# Altium project PCB_Project1.PrjPCB
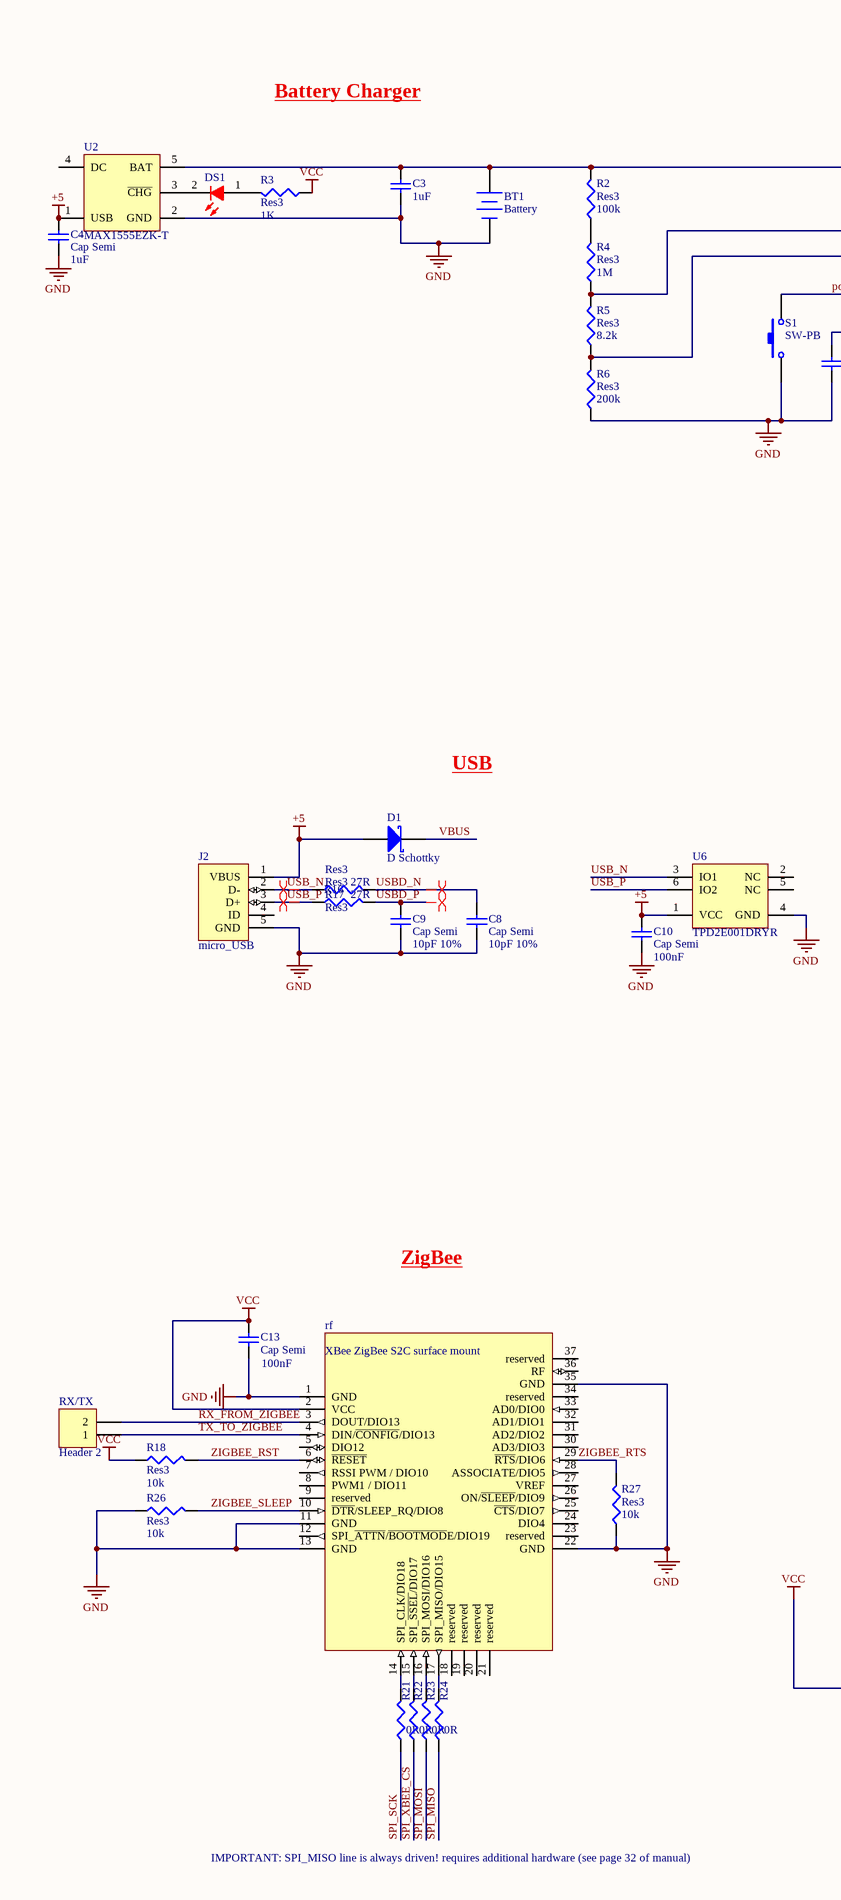
[diagram p0: mainboard.SchDoc, left]
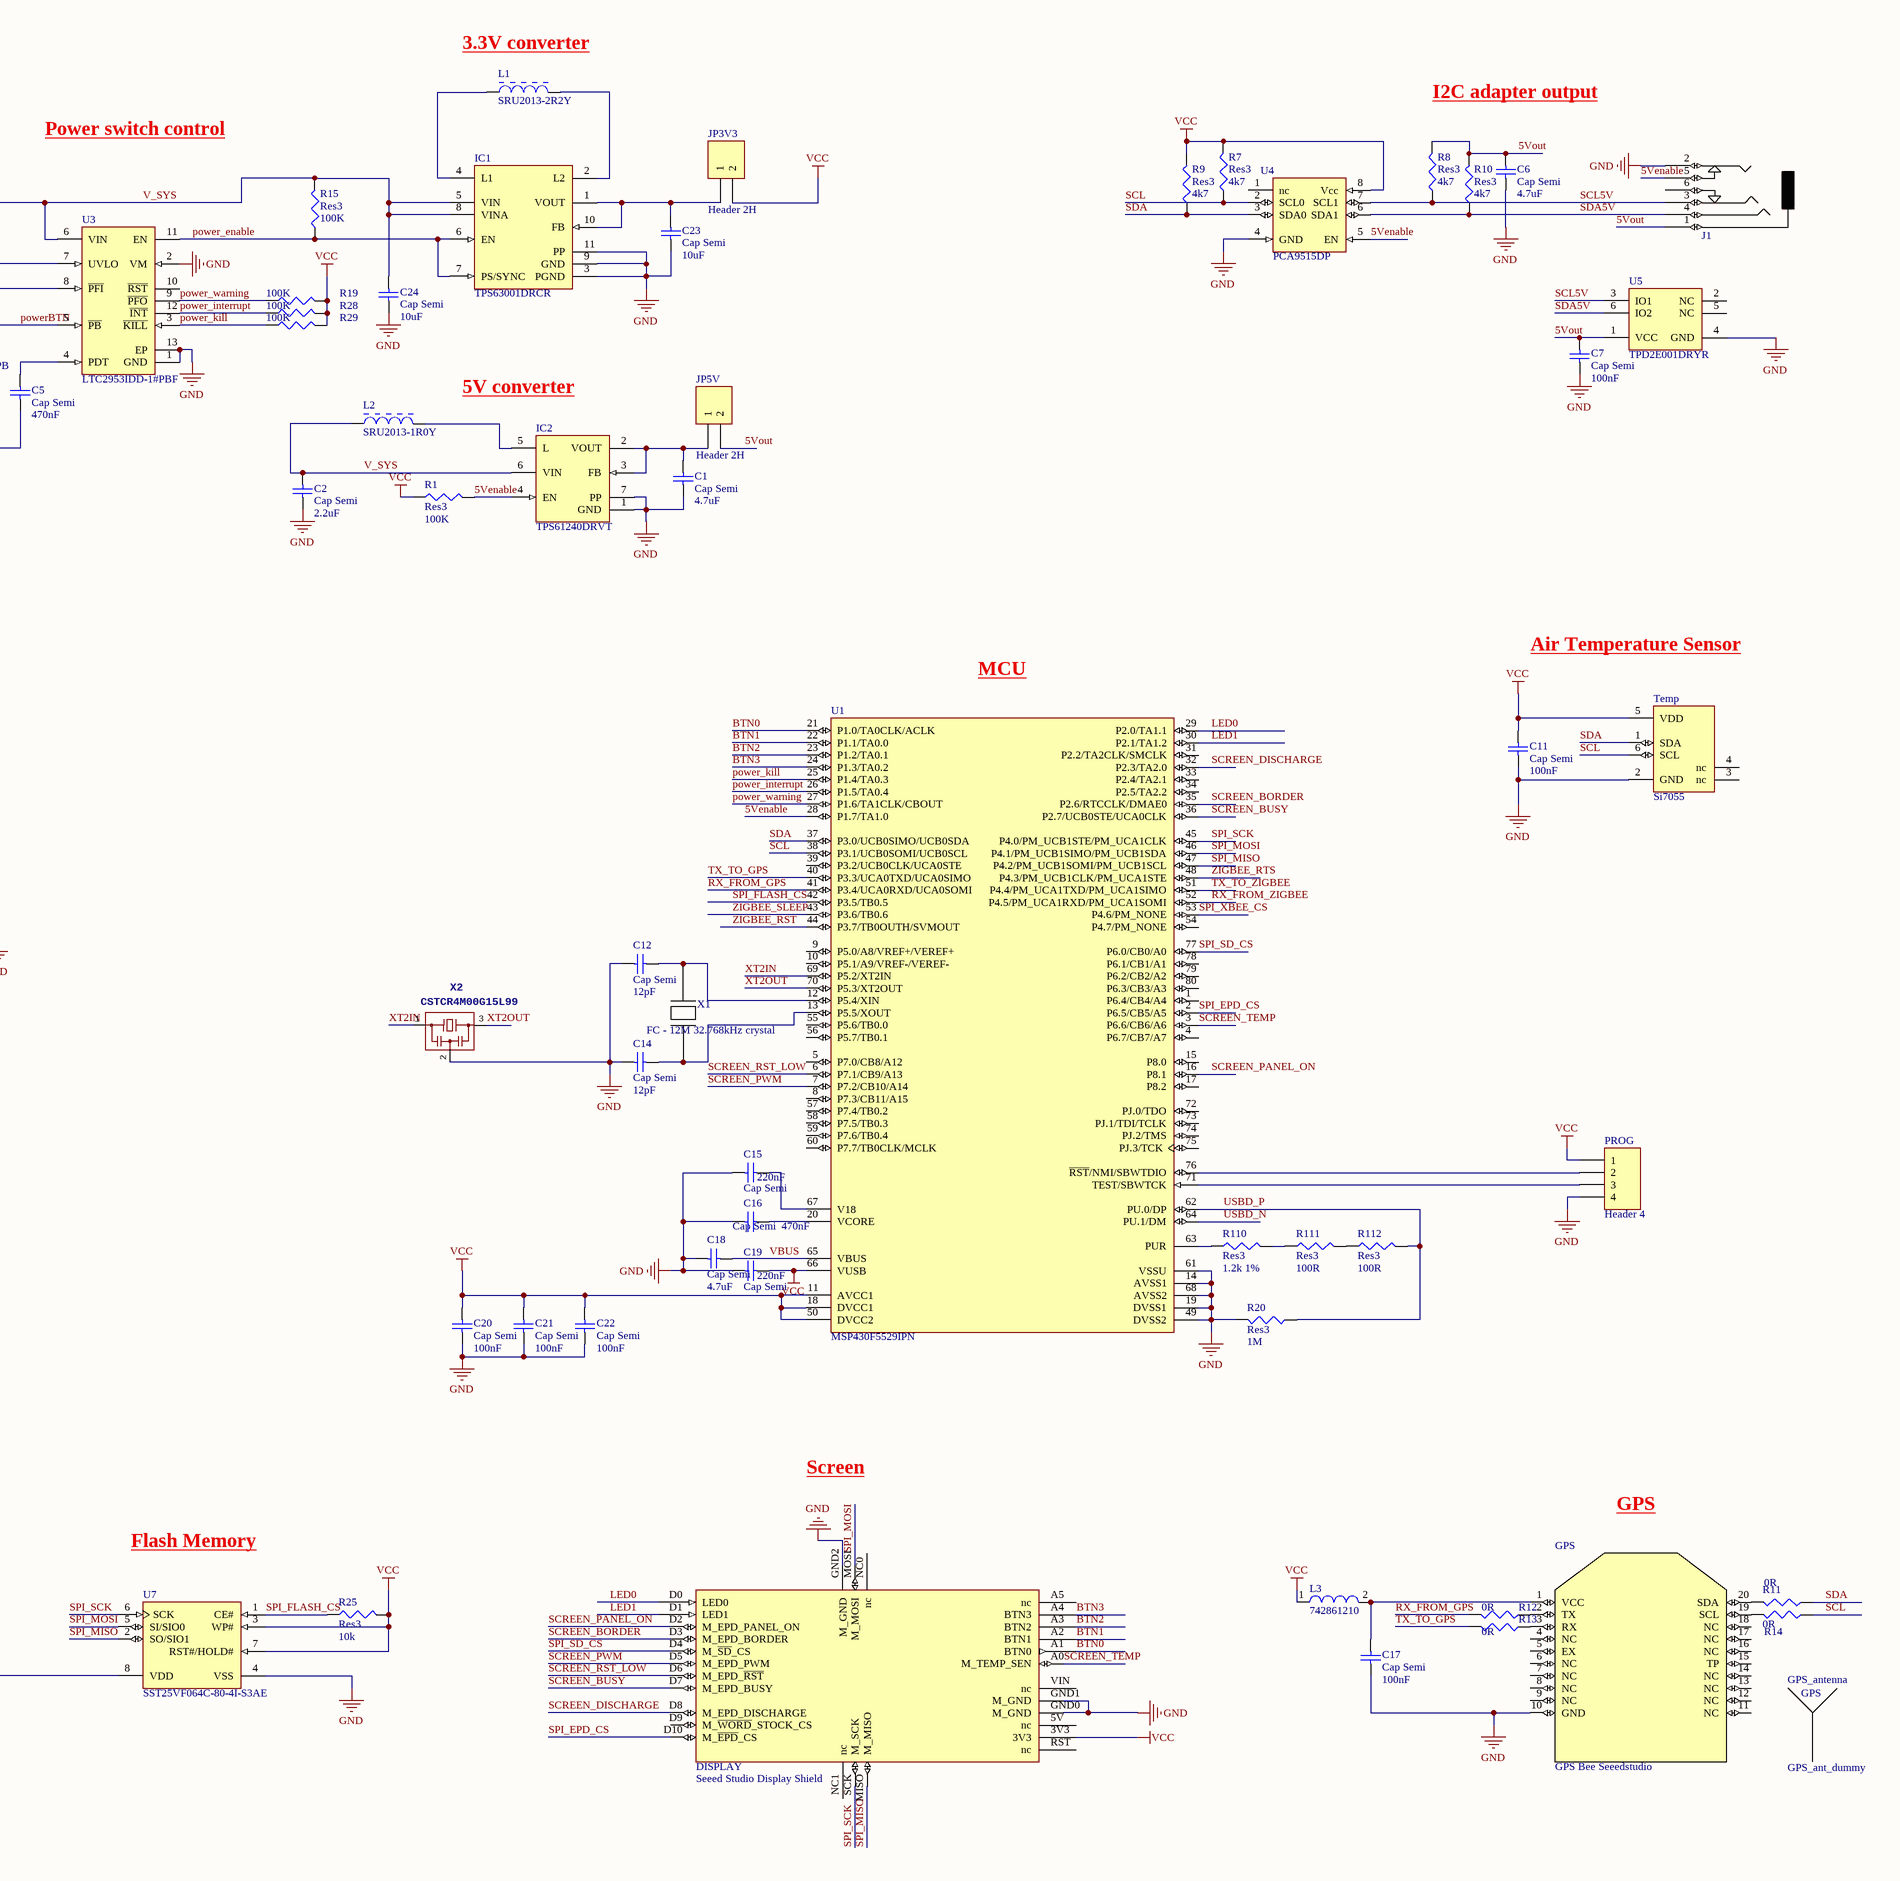
[diagram p1: mainboard.SchDoc, right]
1 sheet, 85 parts. Net scope: global (net labels, ports and power ports of the same name join across sheets).
Board file: mainboardDory.PcbDoc

## Sheet mainboard.SchDoc: dOry mainboard
size A2; Author: Raffael Tschui; DrawnBy: Raffael Tschui; Organization: OWNERPARTID=-1; DocumentNumber: 1; Revision: A; SheetNumber: 1; SheetTotal: 1; PageSetup: Record=PageOptions|CenterHorizontal=True|CenterVertical=True|PrintScale=0.50|XCorrection=1.00|YCorrection=1.00|PrintKind=1|BorderSize=5000000|LeftOffset=0|BottomOffset=0|Orientation=2|PaperLength=1000|PaperWidth=1000|Scale=100|PaperSource=7|PrintQuality=-3|MediaType=1|DitherType=10|PrintScaleMode=1|PaperKind=A4|PaperIndex=9; ProjectName: OWNERPARTID=-1

### Parts
BT1  Battery  [BAT-2]
C1  Cap Semi  value 4.7uF  [1608[0603]]
C2  Cap Semi  value 2.2uF  [1608[0603]]
C3  value 1uF  [1608[0603]]  (hidden comment: Cap Semi)
C4  Cap Semi  value 1uF  [1608[0603]]
C5  Cap Semi  value 470nF  [1608[0603]]
C6  Cap Semi  value 4.7uF  [1608[0603]]
C7  Cap Semi  value 100nF  [1608[0603]]
C8  Cap Semi  value 10pF 10%  [1608[0603]]
C9  Cap Semi  value 10pF 10%  [1608[0603]]
C10  Cap Semi  value 100nF  [1608[0603]]
C11  Cap Semi  value 100nF  [1608[0603]]
C12  Cap Semi  value 12pF  [1608[0603]]
C13  Cap Semi  value 100nF  [1608[0603]]
C14  Cap Semi  value 12pF  [1608[0603]]
C15  Cap Semi  value 220nF  [1608[0603]]
C16  Cap Semi  value 470nF  [1608[0603]]
C17  Cap Semi  value 100nF  [1608[0603]]
C18  Cap Semi  value 4.7uF  [1608[0603]]
C19  Cap Semi  value 220nF  [1608[0603]]
C20  Cap Semi  value 100nF  [1608[0603]]
C21  Cap Semi  value 100nF  [1608[0603]]
C22  Cap Semi  value 100nF  [1608[0603]]
C23  Cap Semi  value 10uF  [C1206]
C24  Cap Semi  value 10uF  [C1206]
D1  D Schottky  [SMB]
DISPLAY  Seeed Studio Display Shield  [Display shield]
DS1  TLSU1008A(T04)  [TOSH-0603LED_RED_V]  (value not drawn)
GPS  GPS Bee Seeedstudio  [GPS bee]
GPS_antenna  GPS_ant_dummy  [GPS_ant_dummy]
IC1  TPS63001DRCR  [DRC10-2400X1650TP]
IC2  TPS61240DRVT  [DRV6-1600X1000TP]
J1  Jack_6  [Jack_6_socket]  (value not drawn)
J2  micro_USB  [DX4RNW5HJ3]
JP3V3  Header 2H  [HDR1X2H]
JP5V  Header 2H  [HDR1X2H]
L1  SRU2013-2R2Y  [BOUR-SRU2013-2R2Y-2_V]
L2  SRU2013-1R0Y  [BOUR-SRU2013-2R2Y-2_V]
L3  742861210  [SMD-0603]
PROG  Header 4  [HDR1X4]
R1  Res3  value 100K  [J1-0603]
R2  Res3  value 100k  [J1-0603]
R3  Res3  value 1K  [J1-0603]
R4  Res3  value 1M  [J1-0603]
R5  Res3  value 8.2k  [J1-0603]
R6  Res3  value 200k  [J1-0603]
R7  Res3  value 4k7  [J1-0603]
R8  Res3  value 4k7  [J1-0603]
R9  Res3  value 4k7  [J1-0603]
R10  Res3  value 4k7  [J1-0603]
R11  value 0R  [J1-0603]  (hidden comment: Res3)
R12  value 0R  [J1-0603]  (hidden comment: Res3)
R13  value 0R  [J1-0603]  (hidden comment: Res3)
R14  value 0R  [J1-0603]  (hidden comment: Res3)
R15  Res3  value 100K  [J1-0603]
R16  Res3  value 27R  [J1-0603]
R17  Res3  value 27R  [J1-0603]
R18  Res3  value 10k  [J1-0603]
R19  value 100K  [J1-0603]  (hidden comment: Res3)
R20  Res3  value 1M  [J1-0603]
R21  value 0R  [J1-0603]  (hidden comment: Res3)
R22  value 0R  [J1-0603]  (hidden comment: Res3)
R23  value 0R  [J1-0603]  (hidden comment: Res3)
R24  value 0R  [J1-0603]  (hidden comment: Res3)
R25  Res3  value 10k  [J1-0603]
R26  Res3  value 10k  [J1-0603]
R27  Res3  value 10k  [J1-0603]
R28  value 100K  [J1-0603]  (hidden comment: Res3)
R29  value 100K  [J1-0603]  (hidden comment: Res3)
R110  Res3  value 1.2k 1%  [J1-0603]
R111  Res3  value 100R  [J1-0603]
R112  Res3  value 100R  [J1-0603]
rf  XBee ZigBee S2C surface mount  [S2C XBEE]
RX/TX  Header 2  [HDR1X2]
S1  SW-PB  [SPST-2]
Temp  Si7055  [Si7050/3/4/5]
U1  MSP430F5529IPN  [TI-PN80_N]
U2  MAX1555EZK-T  [MAXM-Z5-1_N]
U3  LTC2953IDD-1#PBF  [LT-DD-12_V]
U4  PCA9515DP  [TSOP65P490X110-8N]
U5  TPD2E001DRYR  [DRY6]
U6  TPD2E001DRYR  [DRY6]
U7  SST25VF064C-80-4I-S3AE  [MCHP-SOIC-S3A8_M]
X1  FC - 12M 32.768kHz crystal  [FC-12M]
X2  CSTCR4M00G15L99  [CSTCR_G15L]

### Nets
+5: C4.2 C10.2 D1.1(A) J2.1(VBUS) U2.1(USB) U6.1(VCC)
GND: BT1.2(-) C1.1 C2.1 C3.1 C4.1 C5.1 C6.1 C7.1 C8.1 C9.1 C10.1 C11.1 C12.1 C13.1 C14.1 C15.2 C16.2 C17.1 C18.1 C19.2 C20.1 C21.1 C22.1 C23.1 C24.2 DISPLAY.GND0(M_GND) DISPLAY.GND1(M_GND) DISPLAY.GND2(M_GND) GPS.10(GND) IC1.3(PGND) IC1.9(GND) IC1.11(PP) IC2.1(GND) IC2.7(PP) J1.2(tip) J2.5(GND) PROG.4 R6.1 R20.2 R26.1 R27.1 rf.1(GND) rf.11(GND) rf.13(GND) rf.22(GND) rf.35(GND) S1.1 Temp.2(GND) U1.14(AVSS1) U1.19(DVSS1) U1.49(DVSS2) U1.61(VSSU) U1.68(AVSS2) U2.2(GND) U3.1(GND) U3.2(VM) U3.13(EP) U4.4(GND) U5.4(GND) U6.4(GND) U7.4(VSS) X2.2
VCC: C11.2 C13.2 C19.1 C20.2 C21.2 C22.2 DISPLAY.3V3 JP3V3.2 L3.1 PROG.1 R1.1 R3.1 R7.2 R9.2 R18.1 R19.2 R25.2 R28.2 R29.2 rf.2(VCC) Temp.5(VDD) U1.11(AVCC1) U1.18(DVCC1) U1.50(DVCC2) U1.66(VUSB) U4.8(Vcc) U7.3(WP#) U7.7(RST#/HOLD#) U7.8(VDD)
5Venable: IC2.4(EN) J1.5(tip_switch) R1.2 U1.28(P1.7/TA1.0) U4.5(EN)
5Vout: C6.2 C7.2 J1.1(sleeve) JP5V.2 R8.2 R10.2 U5.1(VCC)
BTN0: DISPLAY.A1(BTN0) U1.21(P1.0/TA0CLK/ACLK)
BTN1: DISPLAY.A2(BTN1) U1.22(P1.1/TA0.0)
BTN2: DISPLAY.A3(BTN2) U1.23(P1.2/TA0.1)
BTN3: DISPLAY.A4(BTN3) U1.24(P1.3/TA0.2)
LED0: DISPLAY.D0(LED0) U1.29(P2.0/TA1.1)
LED1: DISPLAY.D1(LED1) U1.30(P2.1/TA1.2)
power_enable: IC1.6(EN) IC1.7(PS/SYNC) R15.1 U3.11(EN)
power_interrupt: R28.1 U1.26(P1.5/TA0.4) U3.12(~{INT})
power_kill: R29.1 U1.25(P1.4/TA0.3) U3.3(~{KILL})
power_warning: R19.1 U1.27(P1.6/TA1CLK/CBOUT) U3.9(~{PFO})
powerBTN: S1.2 U3.5(~{PB})
RX_FROM_GPS: R12.2 U1.41(P3.4/UCA0RXD/UCA0SOMI)
RX_FROM_ZIGBEE: rf.3(DOUT/DIO13) RX/TX.2 U1.52(P4.5/PM_UCA1RXD/PM_UCA1SOMI)
SCL: R7.1 R14.1 Temp.6(SCL) U1.38(P3.1/UCB0SOMI/UCB0SCL) U4.2(SCL0)
SCL5V: J1.3(ring_1) R8.1 U4.7(SCL1) U5.3(IO1)
SCREEN_BORDER: DISPLAY.D3(M_EPD_BORDER) U1.35(P2.6/RTCCLK/DMAE0)
SCREEN_BUSY: DISPLAY.D7(M_EPD_BUSY) U1.36(P2.7/UCB0STE/UCA0CLK)
SCREEN_DISCHARGE: DISPLAY.D8(M_EPD_DISCHARGE) U1.32(P2.3/TA2.0)
SCREEN_PANEL_ON: DISPLAY.D2(M_EPD_PANEL_ON) U1.16(P8.1)
SCREEN_PWM: DISPLAY.D5(M_EPD_PWM) U1.7(P7.2/CB10/A14)
SCREEN_RST_LOW: DISPLAY.D6(M_EPD_~{RST}) U1.6(P7.1/CB9/A13)
SCREEN_TEMP: DISPLAY.A0(M_TEMP_SEN) U1.3(P6.6/CB6/A6)
SDA: R9.1 R11.1 Temp.1(SDA) U1.37(P3.0/UCB0SIMO/UCB0SDA) U4.3(SDA0)
SDA5V: J1.4(ring_2) R10.1 U4.6(SDA1) U5.6(IO2)
SPI_EPD_CS: DISPLAY.D10(M_~{EPD}_CS) U1.2(P6.5/CB5/A5)
SPI_FLASH_CS: R25.1 U1.42(P3.5/TB0.5) U7.1(CE#)
SPI_MISO: DISPLAY.MISO(M_MISO) R24.1 U1.47(P4.2/PM_UCB1SOMI/PM_UCB1SCL) U7.2(SO/SIO1)
SPI_MOSI: DISPLAY.MOSI(M_MOSI) R23.1 U1.46(P4.1/PM_UCB1SIMO/PM_UCB1SDA) U7.5(SI/SIO0)
SPI_SCK: DISPLAY.SCK(M_SCK) R21.1 U1.45(P4.0/PM_UCB1STE/PM_UCA1CLK) U7.6(SCK)
SPI_SD_CS: DISPLAY.D4(M_~{SD}_CS) U1.77(P6.0/CB0/A0)
SPI_XBEE_CS: R22.1 U1.53(P4.6/PM_NONE)
TX_TO_GPS: R13.2 U1.40(P3.3/UCA0TXD/UCA0SIMO)
TX_TO_ZIGBEE: rf.4(DIN/~{CONFIG}/DIO13) RX/TX.1 U1.51(P4.4/PM_UCA1TXD/PM_UCA1SIMO)
USB_N: J2.2(D-) R17.1 U6.3(IO1)
USB_P: J2.3(D+) R16.1 U6.6(IO2)
USBD_N: C8.2 R17.2 U1.64(PU.1/DM)
USBD_P: C9.2 R16.2 R20.1 R112.2 U1.62(PU.0/DP)
V_SYS: BT1.1(+) C2.2 C3.2 C24.1 IC1.5(VIN) IC1.8(VINA) IC2.6(VIN) L2.1 R2.2 R15.2 U2.5(BAT) U3.6(VIN)
VBUS: C18.2 D1.2(K) U1.65(VBUS)
XT2IN: U1.69(P5.2/XT2IN) X2.1
XT2OUT: U1.70(P5.3/XT2OUT) X2.3
ZIGBEE_RST: R18.2 rf.6(~{RESET}) U1.44(P3.7/TB0OUTH/SVMOUT)
ZIGBEE_RTS: R27.2 rf.29(~{RTS}/DIO6) U1.48(P4.3/PM_UCB1CLK/PM_UCA1STE)
ZIGBEE_SLEEP: R26.2 rf.10(~{DTR}/SLEEP_RQ/DIO8) U1.43(P3.6/TB0.6)
NetC1_2: C1.2 IC2.2(VOUT) IC2.3(FB) JP5V.1
NetC5_2: C5.2 U3.4(PDT)
NetC12_2: C12.2 U1.12(P5.4/XIN) X1.2
NetC14_2: C14.2 U1.13(P5.5/XOUT) X1.1
NetC15_1: C15.1 U1.67(V18)
NetC16_1: C16.1 U1.20(VCORE)
NetC17_2: C17.2 GPS.1(VCC) L3.2
NetC23_2: C23.2 IC1.1(VOUT) IC1.10(FB) JP3V3.1
NetDS1_1: DS1.1(A) R3.2
NetDS1_2: DS1.2(K) U2.3(~{CHG})
NetGPS_2: GPS.2(TX) R12.1
NetGPS_3: GPS.3(RX) R13.1
NetGPS_19: GPS.19(SCL) R14.2
NetGPS_20: GPS.20(SDA) R11.2
NetIC1_2: IC1.2(L2) L1.2
NetIC1_4: IC1.4(L1) L1.1
NetIC2_5: IC2.5(L) L2.2
NetPROG_2: PROG.2 U1.76(~{RST}/NMI/SBWTDIO)
NetPROG_3: PROG.3 U1.71(TEST/SBWTCK)
NetR2_1: R2.1 R4.2
NetR4_1: R4.1 R5.2 U3.7(UVLO)
NetR5_1: R5.1 R6.2 U3.8(~{PFI})
NetR21_2: R21.2 rf.14(SPI_CLK/DIO18)
NetR22_2: R22.2 rf.15(SPI_~{SSEL}/DIO17)
NetR23_2: R23.2 rf.16(SPI_MOSI/DIO16)
NetR24_2: R24.2 rf.17(SPI_MISO/DIO15)
NetR110_1: R110.1 U1.63(PUR)
NetR110_2: R110.2 R111.1
NetR111_2: R111.2 R112.1

Not connected (* = marked no-connect by the designer): DISPLAY 5V(nc) A5(nc) D9(M_~{WORD}_STOCK_CS) NC0(nc) NC1(nc) RST(nc) VIN(nc); GPS 4(NC) 5(EX) 6(NC) 7(NC) 8(NC) 9(NC) 11(NC) 12(NC) 13(NC) 14(NC) 15(TP) 16(NC) 17(NC) 18(NC); J1 6(ring_1_switch); J2 4(ID); rf 5(DIO12) 7(RSSI_PWM_/_DIO10) 8(PWM1_/_DIO11) 9(reserved) 12(SPI_~{ATTN}/~{BOOTMOD}E/DIO19) 18(reserved) 19(reserved) 20(reserved) 21(reserved) 23(reserved) 24(DIO4) 25(~{CTS}/DIO7) 26(ON/~{SLEEP}/DIO9) 27(VREF) 28(ASSOCIATE/DIO5) 30(AD3/DIO3) 31(AD2/DIO2) 32(AD1/DIO1) 33(AD0/DIO0) 34(reserved) 36(RF) 37(reserved); Temp 3(nc) 4(nc); U1 1(P6.4/CB4/A4) 4(P6.7/CB7/A7) 5(P7.0/CB8/A12) 8(P7.3/CB11/A15) 9(P5.0/A8/VREF+/VEREF+) 10(P5.1/A9/VREF-/VEREF-) 15(P8.0) 17(P8.2) 31(P2.2/TA2CLK/SMCLK) 33(P2.4/TA2.1) 34(P2.5/TA2.2) 39(P3.2/UCB0CLK/UCA0STE) 54(P4.7/PM_NONE) 55(P5.6/TB0.0) 56(P5.7/TB0.1) 57(P7.4/TB0.2) 58(P7.5/TB0.3) 59(P7.6/TB0.4) 60(P7.7/TB0CLK/MCLK) 72(PJ.0/TDO) 73(PJ.1/TDI/TCLK) 74(PJ.2/TMS) 75(PJ.3/TCK) 78(P6.1/CB1/A1) 79(P6.2/CB2/A2) 80(P6.3/CB3/A3); U2 4(DC); U3 10(~{RST}); U4 1(nc); U5 2(NC) 5(NC); U6 2(NC) 5(NC)

### Layout directives
differential pair: USB_N, USB_P, USBD_N, USBD_P

### Notes on the sheet
- (near L1) 3.3V converter
- I2C adapter output
- Battery Charger
- Power switch control
- 5V converter
- Air Temperature Sensor
- MCU
- USB
- ZigBee
- Screen
- GPS
- Flash Memory
- IMPORTANT: SPI_MISO line is always driven! requires additional hardware (see page 32 of manual)
- Title
- Size:
- Date:
- File:
- A2
- Number:
- Time:
- Revision:
- Sheet
- of
- (in symbol GPS_ant_dummy) GPS

### Library data of the parts
BT1 = Battery: Multicell Battery; Published: 24-Mar-1999; LatestRevisionDate: 17-Jul-2002; LatestRevisionNote: Re-released for DXP Platform.; PackageReference: BAT-2; Publisher: Altium Limited; PackageDescription: Battery; 2 Leads
C1-C24 = Cap Semi: Capacitor (Semiconductor SIM Model); Published: 8-Jun-2000; LatestRevisionDate: 29-May-2009; LatestRevisionNote: IPC-7351 Footprint Added.; PackageReference: C1206; Publisher: Altium Limited; PackageDescription: Chip Capacitor
D1 = D Schottky: Schottky Diode; Published: 8-Jun-2000; LatestRevisionDate: 17-Jul-2002; LatestRevisionNote: Re-released for DXP Platform.; PackageReference: SMB; Publisher: Altium Limited; PackageDescription: DO-214-AA/SMB; 2 C-Bend Leads; Body 5.3 x 3.6 mm, inc. leads (LxW); Code_JEDEC: DO-214-AA
DS1 = CMP-0444-00001-1: LED, Red 0603 (1608) 63mCd; Manufacturer: Toshiba; Forward Current: 25 mA; Power Dissipation: 60 mW; Packing Type: Reel; Reverse Voltage: 4 V; Mounting Technology: Surface Mount; PackageDescription: 2-Pin SMT LED, 1.6 x 0.8 mm Pitch; ComponentLink1URL: http://www.toshiba-components.com/; ComponentLink1Description: Manufacturer URL; PackageReference: 0603LED_RED; PartNumber: TLSU1008A(T04); ComponentLink2URL: http://www.semicon.toshiba.co.jp/info/docget.jsp?type=datasheet&lang=en&pid=TLSU1008A(T04); ComponentLink2Description: Datasheet; DatasheetVersion: Aug-08; Storage Temperature: -40 to 100 degC
IC1 = CMP-0345-00006-1: Buck-Boost Voltage Converter with 1.8 to 5.5 V Input and 3.3 V Output, -40 to 85 degC, 10-Pin SON (DRC), Green (RoHS & no Sb/Br); Manufacturer: Texas Instruments; Regulated Outputs(#): 1; Preset Vout(V): 3.3; SubFamily: Buck-Boost Regulator; Iq(Typ)(mA): 0.03; Dynamic Voltage Scaling: TRUE; Vin(Max)(V): 5.5; Vin(Min)(V): 1.8; Switching Frequency(Max)(kHz): 1500; Iout(Max)(A): 1.2; ComponentLink1URL: http://www.ti.com/general/docs/lit/getliterature.tsp?genericPartNumber=TPS63001&fileType=pdf; PartNumber: TPS63001DRCR; PackageDescription: 10-Pin Plastic Small Outline No-Lead, 3 x 3 x 1 mm Body, 0.5 mm Pitch, Exposed Pad; Vout(Min)(V): 3.3; PackageReference: DRC10-2400X1650TP; Topology: Buck-Boost; ComponentLink2Description: Package Specification; Eco-Plan: Green (RoHS & no Sb/Br); PackageVersion: revL, Sep-2011; ComponentLink2URL: http://www.ti.com/litv/pdf/mpds117k; Mounting Technology: Surface Mount; ComponentLink1Description: Datasheet; DatasheetVersion: SLVS520B; Synchronous Rectification: TRUE; Vout(Max)(V): 3.3
IC2 = CMP-0343-00063-1: Boost Voltage Converter with 2.3 to 5.5 V Input and 5 V Output, 6-Pin SON (DRV), Green (RoHS & no Sb/Br); Manufacturer: Texas Instruments; Regulated Outputs(#): 1; Vin(Max)(V): 5.5; Vout(Min)(V): 5; SubFamily: Step-Up Regulator; Synchronous Rectification: TRUE; Switching Frequency(Max)(kHz): 4000; Vin(Min)(V): 2.3; ComponentLink1URL: http://www.ti.com/general/docs/lit/getliterature.tsp?genericPartNumber=TPS61240&fileType=pdf; PackageReference: DRV6-1600X1000TP; Topology: Boost; Mounting Technology: Surface Mount; PackageVersion: revE, Oct-2010; Eco-Plan: Green (RoHS & no Sb/Br); DatasheetVersion: SLVS806B; Vout(Max)(V): 5; PartNumber: TPS61240DRVT; PackageDescription: 6-Pin Plastic Small Outline No-Lead, 2 x 2 x 0.8 mm Body, 0.65 mm Pitch, Exposed Pad; ComponentLink1Description: Datasheet; Preset Vout(V): 5; ComponentLink2URL: http://www.ti.com/litv/pdf/mpds216d; ComponentLink2Description: Package Specification
J1 = Jack_6: 4 pin 6 contact headphone jack 3.5mm
J2 = micro_USB: waterproof USB 2.0 Standard Micro-USB Connector, Micro AB-Standard (Bottom Mount), 30 V AC, -30 to 85 degC, Right Angle, 5-Pin 7.5 x 5.6 x 2.8 mm SMD, RoHS,; PartNumber: ZX62D-AB-5P8; Manufacturer: Hirose Electric; Contact Resistance: 30 mOhm Max.; Packing: Reel; Number of Contacts: 5; Capacitance: 2 pF Max.; Voltage Rating: 30 V AC; Mounting Technology: Surface Mount; ComponentLink2Description: Datasheet; DatasheetVersion: Aug-14; RoHS: TRUE; ComponentLink2URL: http://www.hirose.co.jp/cataloge_hp/ed_ZX_20140804.pdf; Operating Temperature Range: -30 to 85 degC; PackageDescription: USB Micro-AB Connector, Right Angle, Body 7.5 x 5.6 mm, Pitch 0.65 mm, Height 2.8 mm; ComponentLink1URL: http://www.hirose.com/; ComponentLink1Description: Manufacturer URL; ComponentLink3URL: http://www.hirose.co.jp/cataloge_hp/ed_ZX_20140804.pdf; ComponentLink3Description: Package Specification
JP3V3 JP5V = Header 2H: Header, 2-Pin, Right Angle; LatestRevisionDate: 17-Jul-2002; LatestRevisionNote: Re-released for DXP Platform.; Publisher: Altium Limited
L1 = CMP-0462-00001-2: Power Inductor, 2.2 µH, 1.45 Irms Max(A), SMD; Manufacturer: Bourns; Frequency - Self Resonant: 100 MHz; Tolerance: +/-30%; Current Rating: 1.45 A; Inductance: 2.2 uH; DC Resistance (DCR): 120 mOhm Max; Current - Saturation: 950 mA; ComponentLink3URL: http://www.bourns.com/data/global/pdfs/SRU2013.pdf; DatasheetVersion: 2/13/2013; PartNumber: SRU2013-2R2Y; PackageDescription: 2-Pin Hand Drawn, Body 2.8 x 2.8 mm; ComponentLink2URL: http://www.bourns.com/data/global/pdfs/SRU2013.pdf; Mounting Technology: Surface Mount; PackageReference: SRU2013-2R2Y-2; ComponentLink3Description: Package Specification; Operating Temperature: -40 to 125 degC; ComponentLink1URL: http://www.bourns.com; ComponentLink2Description: Datasheet; ComponentLink1Description: Manufacturer URL
L2 = CMP-0462-00001-2: Power Inductor, 2.2 µH, 1.45 Irms Max(A), SMD; PartNumber: SRU2013-2R2Y; Manufacturer: Bourns; Frequency - Self Resonant: 100 MHz; Tolerance: +/-30%; Current Rating: 2 A; Inductance: 1.0 uH; DC Resistance (DCR): 120 mOhm Max; Current - Saturation: 950 mA; ComponentLink3URL: http://www.bourns.com/data/global/pdfs/SRU2013.pdf; DatasheetVersion: 2/13/2013; PackageDescription: 2-Pin Hand Drawn, Body 2.8 x 2.8 mm; ComponentLink2URL: http://www.bourns.com/data/global/pdfs/SRU2013.pdf; Mounting Technology: Surface Mount; PackageReference: SRU2013-2R2Y-2; ComponentLink3Description: Package Specification; Operating Temperature: -40 to 125 degC; ComponentLink1URL: http://www.bourns.com; ComponentLink2Description: Datasheet; ComponentLink1Description: Manufacturer URL
L3 = CMP-0220-00121-1: SMD EMI Suppression Ferrite Bead WE-CBF HF, Z = 1000 Ohm; PackageDescription: Chip Inductor, 2-Leads, Body 1.6 x 0.8 mm; PackageReference: SMD-0603; DatasheetVersion: ver 2, Aug-2009; ComponentLink2Description: Datasheet; ComponentLink1Description: Manufacturer Link; Impedance: 1000 Ohm; PackageVersion: 2009; ComponentLink2URL: http://www.we-online.de/katalog/media/pdf/742861210.pdf; ComponentLink1URL: http://www.we-online.com
PROG = Header 4: Header, 4-Pin; LatestRevisionDate: 17-Jul-2002; LatestRevisionNote: Re-released for DXP Platform.; Publisher: Altium Limited
R1-R29 R110-R112 = Res3: Resistor; Published: 8-Jun-2000; LatestRevisionDate: 29-May-2009; LatestRevisionNote: IPC-7351 Footprint Added.; PackageReference: J1-0603; Publisher: Altium Limited; PackageDescription: Chip Resistor
  R16: Comment_1: Res3
RX/TX = Header 2: Header, 2-Pin; LatestRevisionDate: 17-Jul-2002; LatestRevisionNote: Re-released for DXP Platform.; Publisher: Altium Limited
S1 = SW-PB: Switch; Published: 24-Mar-1999; LatestRevisionDate: 17-Jul-2002; LatestRevisionNote: Re-released for DXP Platform.; PackageReference: SPST-2; Publisher: Altium Limited; PackageDescription: Switch; 2 Leads
U1 = CMP-0365-00412-1: 25 MHz Mixed Signal Microcontroller with 128 KB Flash, 8192 B SRAM and 63 GPIOs, -40 to 85 degC, 80-pin QFP (PN), Green (RoHS & no Sb/Br); Manufacturer: Texas Instruments; Real-Time Clock: Yes; Multiplier: 32x32; Frequency(MHz): 25; USCI_A (UART/LIN/IrDA/SPI): 2; SubFamily: 5 Series; Timers - 16-bit: 4; ADC Channels: 16; GPIO: 63; SRAM(B): 8192; DMA: 3; ADC: 12-bit SAR; Flash(KB): 128; USB: 1; Code_JEDEC: MS-018; ComponentLink1URL: http://www.ti.com/; ComponentLink2URL: http://www.ti.com/general/docs/lit/getliterature.tsp?genericPartNumber=MSP430F5529&fileType=pdf; Brown Out Reset: Yes; SVS: Yes; ComponentLink2Description: Datasheet; Comparators: Yes; ComponentLink3Description: Package Specification; ComponentLink1Description: Manufacturer URL; PackageDescription: 80-Pin Plastic Quad Flat Pack, Body 12 x 12 mm, Pitch 0.5 mm; PartNumber: MSP430F5529IPN; USCI_B (I2C & SPI): 2; PackageReference: PN80; Watchdog: Yes; Temp Sensor: Yes; Eco-Plan: Green (RoHS & no Sb/Br); ComponentLink3URL: http://www.ti.com/lit/ml/mtqf010a/mtqf010a.pdf; Mounting Technology: Surface Mount; DatasheetVersion: SLAS590I
U2 = CMP-0246-00653-1: Dual-Input USB/AC Adapter 1-Cell Li+ Battery Charger, 4.2 V Charger Voltage, 0.28 A DC Charging Current, 5-Pin SOT23 Package, Tape and Reel; Manufacturer: Maxim; ICHG Typ: 0.28 A; Max Protected VIN (V): 7; Charger (V): 4.2; Lithium Ion Cells: 1; ComponentLink1Description: Manufacturer URL; Operating Temperature Range: -40 to 85 degC; PackageDescription: 5-Pin Thin SOT23, Body 2.9 x 1.6 mm, Pitch 0.95 mm; Mounting Technology: Surface Mount; PartNumber: MAX1555EZK-T; Package: SOT-23; Max Charging VIN (V): 7; ComponentLink2URL: http://datasheets.maximintegrated.com/en/ds/MAX1551-MAX1555.pdf; DatasheetVersion: Rev. 0; Packing: Tape and Reel; ComponentLink3Description: Package Specification; ComponentLink2Description: Datasheet; ComponentLink3URL: http://pdfserv.maximintegrated.com/package_dwgs/21-0113.PDF; PackageReference: Z5-1; PackageVersion: Rev. D; ComponentLink1URL: http://www.maximintegrated.com/
U3 = CMP-0482-00128-1: Push Button On / Off Controller with Voltage Monitoring, 12-pin SON (DD-12), -40 to 85 degC, Pb-Free; Manufacturer: Linear Technology; Number of Supplies(#): 1; ComponentLink2URL: http://cds.linear.com/docs/en/datasheet/2953f.pdf; PackageReference: DD-12; ComponentLink2Description: Datasheet; ComponentLink1Description: Manufacturer URL; PackageDescription: 12-Pin Plastic DFN, Body 3 x 3 mm, Pitch 0.45 mm; RoHS: TRUE; ComponentLink3URL: http://cds.linear.com/docs/en/packaging/DFN_12_05-08-1725.pdf; ComponentLink3Description: Package Specification; PackageVersion: Rev. A, 06/2010; PartNumber: LTC2953IDD-1#PBF; ComponentLink1URL: http://www.linear.com/; Mounting Technology: Surface Mount
U4 = PCA9515DP: PCA9515 I2C logic level converter
U5 U6 = TI-TPD2E001-SON_DRY-6: Low-Capacitance + / - 15 kV ESD-Protection Array for High-Speed Data Interfaces, 2 Channels, -40 to +85 degC, 6-pin SON (DRY), Green (RoHS & no Sb/Br); Manufacturer: Texas Instruments; SubFamily: ESD Solution; IEC 61000-4-2 Air-Gap(+/- kV): 15; IO Capacitance(Typ)(pF): 1.5; Breakdown Voltage(Min)(V): 11; IO Leakage Current(nA): 1; IEC 61000-4-2 Contact(+/- kV): 8; USB High Speed: TRUE; ComponentLink2URL: SamplesURL:http://www.ti.com/product/tpd2e001#samples; Mounting Technology: Surface Mount; ComponentLink1URL: http://www.ti.com/general/docs/lit/getliterature.tsp?genericPartNumber=TPD2E001&fileType=pdf; PackageVersion: revF, Dec-2011; PackageReference: DRY6; Eco-Plan: Green (RoHS & no Sb/Br); ComponentLink2Description: URL Link1; PartNumber: TPD2E001DRYR; DatasheetVersion: SLLS684F; PackageDescription: 6-Pin Plastic Small Outline No-Lead, 1 x 1.45 x 0.6 mm Body, 0.5 mm Pitch; ComponentLink1Description: Datasheet
U7 = CMP-0378-00064-1: 64 Mbit SPI Serial Flash, 2.7 to 3.6 V, 80 MHz, -40 to 85 degC, 8-pin SOIC (S3A8), Tube; Manufacturer: Microchip; ComponentLink2URL: http://ww1.microchip.com/downloads/en/DeviceDoc/25036B.pdf; ComponentLink3URL: http://ww1.microchip.com/downloads/en/DeviceDoc/25036B.pdf; PackageDescription: 8-Lead Small Outline, 7.21 x 5.28 mm Body, 1.27 mm Pitch; ComponentLink4Description: Product URL; PartNumber: SST25VF064C-80-4I-S3AE; PackageVersion: Rev. B; ComponentLink2Description: Datasheet; DatasheetVersion: Rev. B; ComponentLink4URL: http://www.microchip.com/SST25VF064C; PackageReference: SOIC-S3A8; Mounting Technology: Surface Mount; ComponentLink1Description: Manufacturer URL; ComponentLink3Description: Package Specification; ComponentLink1URL: http://www.microchip.com
X1 = FC - 12M 32.768kHz crystal: Epson FC - 12M
X2 = MURATA-FILTER_CSTCR: <b>Resonator</b><p> / Source: murata.co.jp